# EAGLE design V5 (EAGLE 9.5.2)
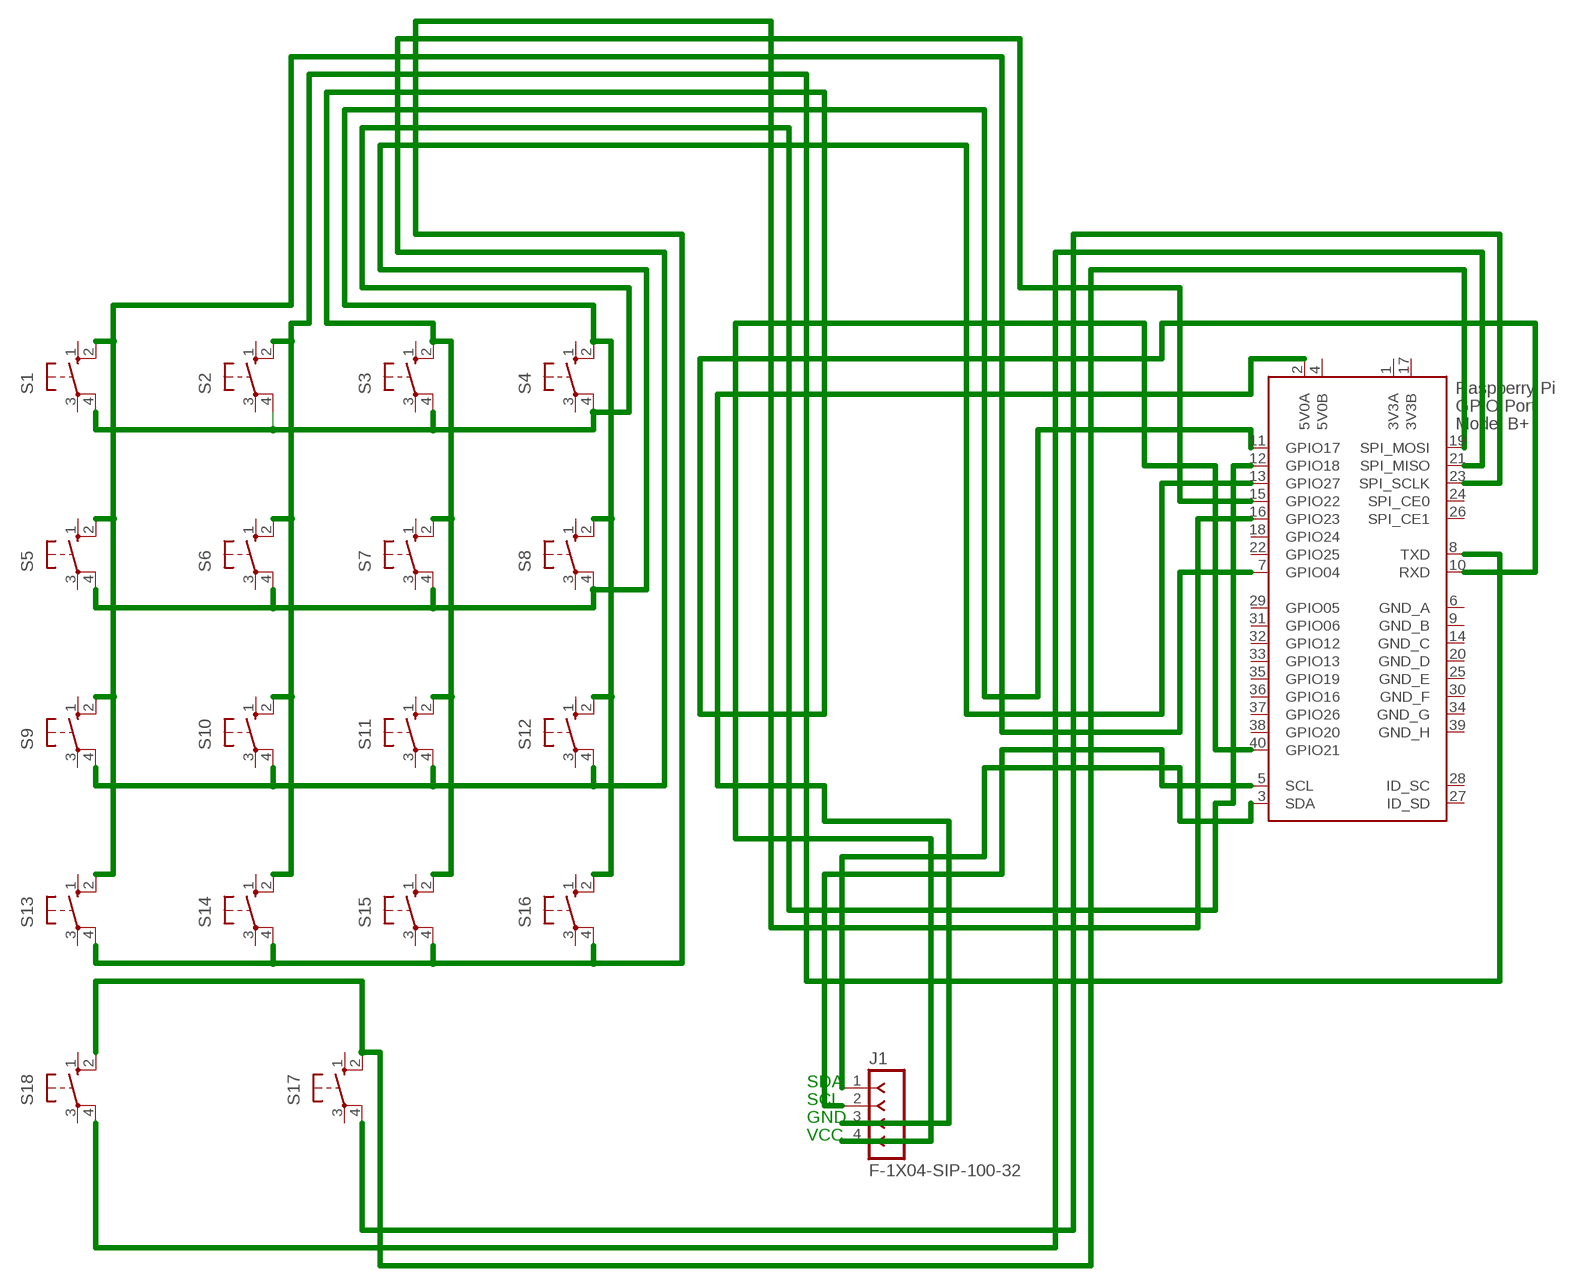
[diagram p0: schematic, sheet 1]

## Parts
J1  F-1X04-SIP-100-32  [SIP-100-04-32]
S1  40-XX  [B3F-40XX]
S2  40-XX  [B3F-40XX]
S3  40-XX  [B3F-40XX]
S4  40-XX  [B3F-40XX]
S5  40-XX  [B3F-40XX]
S6  40-XX  [B3F-40XX]
S7  40-XX  [B3F-40XX]
S8  40-XX  [B3F-40XX]
S9  40-XX  [B3F-40XX]
S10  40-XX  [B3F-40XX]
S11  40-XX  [B3F-40XX]
S12  40-XX  [B3F-40XX]
S13  40-XX  [B3F-40XX]
S14  40-XX  [B3F-40XX]
S15  40-XX  [B3F-40XX]
S16  40-XX  [B3F-40XX]
S17  40-XX  [B3F-40XX]
S18  40-XX  [B3F-40XX]
X1  RASPI_GPIO_B+#_PIN  [RASPI_GPIO_B+_PIN]

## Nets
N$1: S1.2(S1) S5.2(S1) S9.2(S1) S13.2(S1) X1.7(GPIO04)
N$2: S2.2(S1) S6.2(S1) S10.2(S1) S14.2(S1) X1.8(TXD)
N$3: S3.2(S1) S7.2(S1) S11.2(S1) S15.2(S1) X1.10(RXD)
N$4: J1.4 X1.40(GPIO21)
N$5: S13.4(P1) S14.4(P1) S15.4(P1) S16.4(P1) X1.16(GPIO23)
N$6: S9.4(P1) S10.4(P1) S11.4(P1) S12.4(P1) X1.15(GPIO22)
N$7: S5.4(P1) S6.4(P1) S7.4(P1) S8.4(P1) X1.13(GPIO27)
N$8: S1.4(P1) S2.4(P1) S3.4(P1) S4.4(P1) X1.12(GPIO18)
N$9: S17.2(S1) S18.2(S1) X1.19(SPI_MOSI)
N$10: S18.4(P1) X1.21(SPI_MISO)
N$11: S17.4(P1) X1.23(SPI_SCLK)
N$15: J1.1 X1.3(SDA)
N$16: J1.2 X1.5(SCL)
N$18: J1.3 X1.2(5V0A)
N$19: S4.2(S1) S8.2(S1) S12.2(S1) S16.2(S1) X1.11(GPIO17)
Unconnected: S1.1(S) S1.3(P) S2.1(S) S2.3(P) S3.1(S) S3.3(P) S4.1(S) S4.3(P) S5.1(S) S5.3(P) S6.1(S) S6.3(P) S7.1(S) S7.3(P) S8.1(S) S8.3(P) S9.1(S) S9.3(P) S10.1(S) S10.3(P) S11.1(S) S11.3(P) S12.1(S) S12.3(P) S13.1(S) S13.3(P) S14.1(S) S14.3(P) S15.1(S) S15.3(P) S16.1(S) S16.3(P) S17.1(S) S17.3(P) S18.1(S) S18.3(P) X1.18(GPIO24) X1.22(GPIO25) X1.24(SPI_CE0) X1.26(SPI_CE1) X1.27(ID_SD) X1.28(ID_SC) X1.29(GPIO05) X1.31(GPIO06) X1.32(GPIO12) X1.33(GPIO13) X1.35(GPIO19) X1.36(GPIO16) X1.37(GPIO26) X1.38(GPIO20)

## Notes on the sheet
- SDA
- SCL
- GND
- VCC

## Power pins joined to a net without a drawn wire
3V3A: X1.1(3V3A)
3V3B: X1.17(3V3B)
5V0B: X1.4(5V0B)
GND_A: X1.6(GND_A)
GND_B: X1.9(GND_B)
GND_C: X1.14(GND_C)
GND_D: X1.20(GND_D)
GND_E: X1.25(GND_E)
GND_F: X1.30(GND_F)
GND_G: X1.34(GND_G)
GND_H: X1.39(GND_H)

## Library data of the parts
J1 = con-headers-jp:F-1X04-: FEMALE HEADER
S1-S18 = switch-omron:40-XX: OMRON SWITCH; MF: OMRON COMPONENTS USA; MPN: B3F-4000; OC_FARNELL: 176434; OC_NEWARK: 36K3105
X1 = raspberrypi_bastelstube_v13:RASPI_GPIO_B+#: 2x20 header connector, all pins connected

## Net classes
0 default: width 0.33 mm, clearance 0.33 mm

## Board
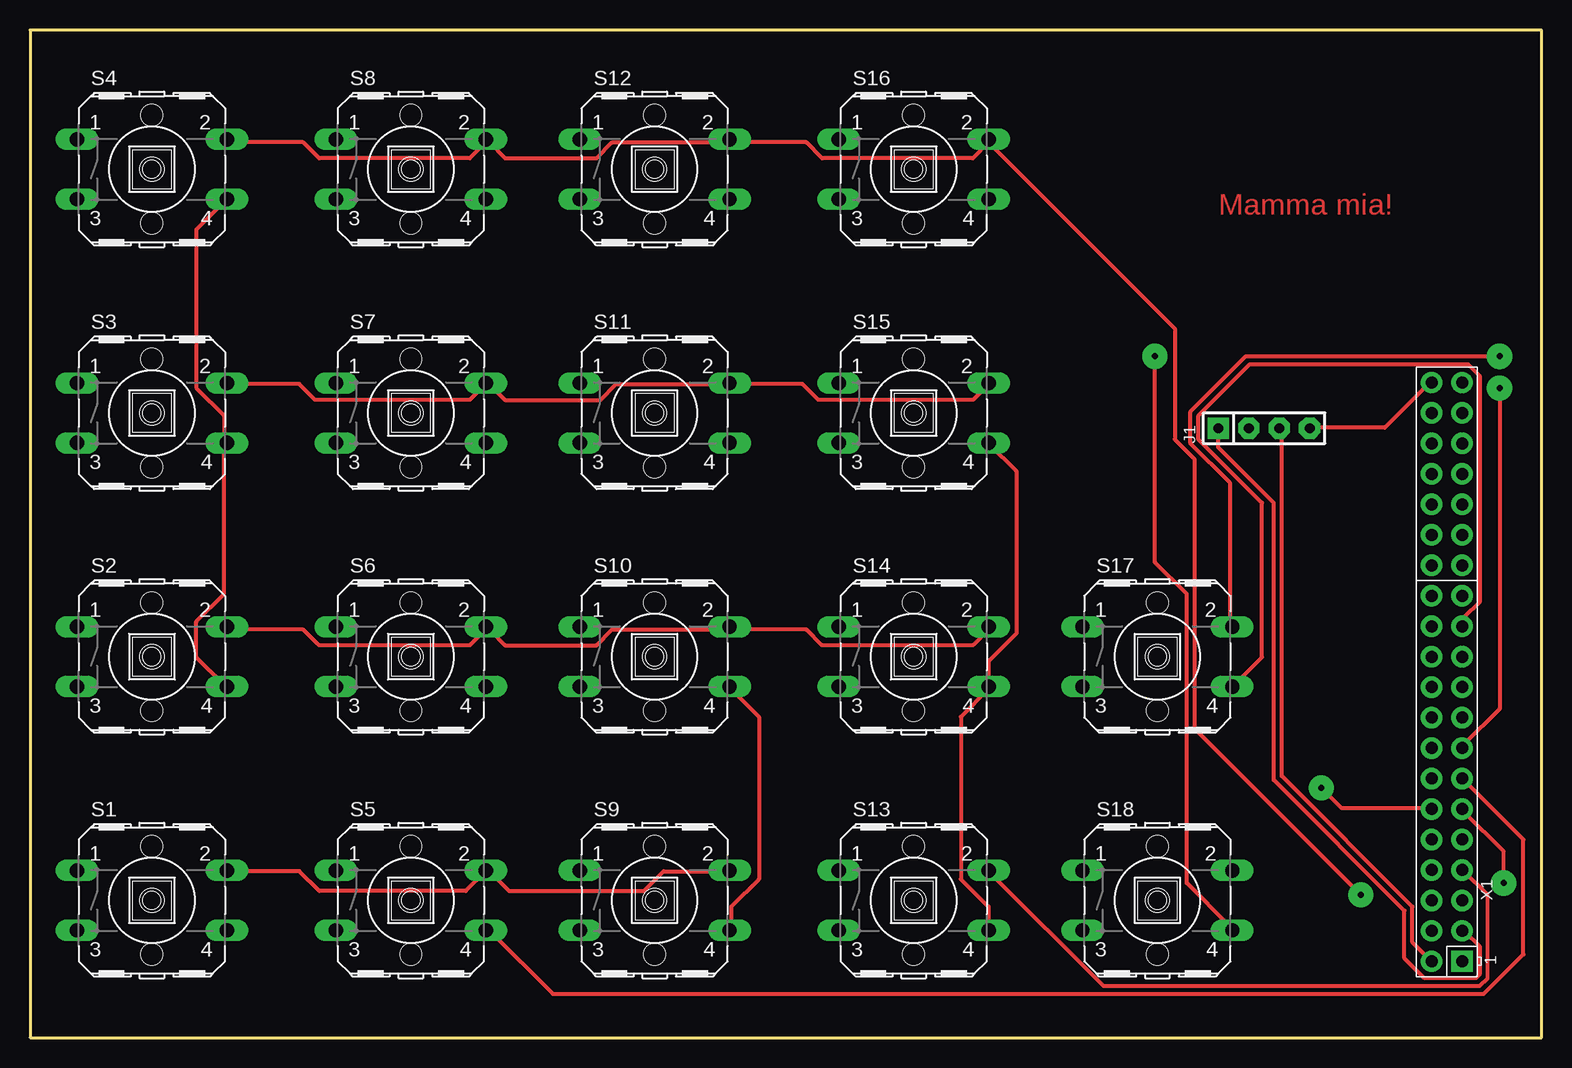
[diagram p1: board, top side]
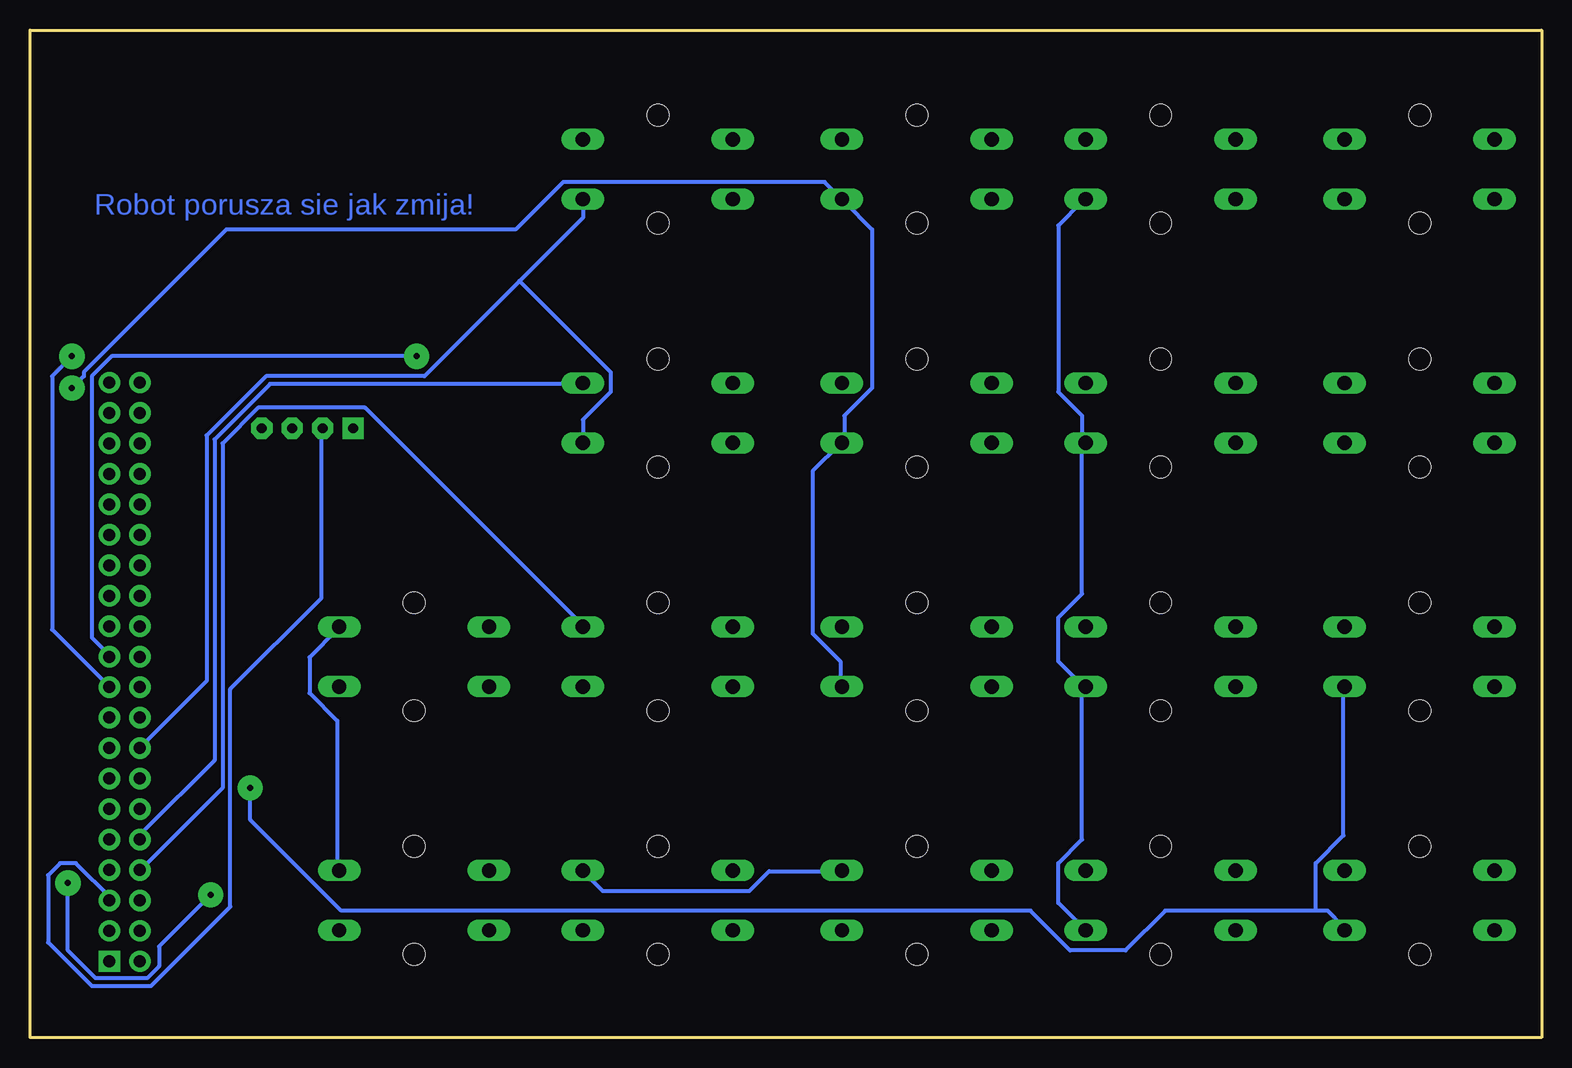
[diagram p2: board, bottom side, seen from below]

Size 126 x 84 mm. Coordinates in mm from the lower left corner, seen from the top.
Outline: 0,84 0,0 126,0 126,84 0,84
Copper layers (1*16): Top 0.035mm / dielectric 1.5mm / Bottom 0.035mm
Design rules "default *": minimum track width 6mil, minimum drill 0.5mm, track to track 13mil, track to pad 13mil, pad to pad 13mil, via to via 13mil, smd to smd 13mil, copper to edge 40mil, drill to drill 6mil, minimum pad ring 10mil, minimum via ring 0.8mm, stop-mask expansion 4mil, vias tented up to drill 0mil, thermal gap 10mil

### Footprints (pad centres in the part's own frame; a part is rotated, then mirrored left to right if it is on the bottom)
SIP-100-04-32 = drill 0.813 pad 1.778 square: 1 -3.81,0 | drill 0.813 pad 1.778 octagon: 2 -1.27,0; 3 1.27,0; 4 3.81,0
B3F-40XX = drill 1.194 long: 1 -6.248,2.489; 2 6.248,2.489; 3 -6.248,-2.489; 4 6.248,-2.489 | hole 1.803: 0,-4.496; 0,4.496
RASPI_GPIO_B+_PIN = drill 1 pad 1.778 square: 1 -24.13,-1.27 | drill 1 pad 1.778: 2 -24.13,1.27; 3 -21.59,-1.27; 4 -21.59,1.27; 5 -19.05,-1.27; 6 -19.05,1.27; 7 -16.51,-1.27; 8 -16.51,1.27; 9 -13.97,-1.27; 10 -13.97,1.27; 11 -11.43,-1.27; 12 -11.43,1.27; 13 -8.89,-1.27; 14 -8.89,1.27; 15 -6.35,-1.27; 16 -6.35,1.27; 17 -3.81,-1.27; 18 -3.81,1.27; 19 -1.27,-1.27; 20 -1.27,1.27; 21 1.27,-1.27; 22 1.27,1.27; 23 3.81,-1.27; 24 3.81,1.27; 25 6.35,-1.27; 26 6.35,1.27; 27 8.89,-1.27; 28 8.89,1.27; 29 11.43,-1.27; 30 11.43,1.27; 31 13.97,-1.27; 32 13.97,1.27; 33 16.51,-1.27; 34 16.51,1.27; 35 19.05,-1.27; 36 19.05,1.27; 37 21.59,-1.27; 38 21.59,1.27; 39 24.13,-1.27; 40 24.13,1.27

### Placement (x,y rotation side)
J1  102.87,50.8 0 top
S1  10.16,11.43 0 top
S2  10.16,31.75 0 top
S3  10.16,52.07 0 top
S4  10.16,72.39 0 top
S5  31.75,11.43 0 top
S6  31.75,31.75 0 top
S7  31.75,52.07 0 top
S8  31.75,72.39 0 top
S9  52.07,11.43 0 top
S10  52.07,31.75 0 top
S11  52.07,52.07 0 top
S12  52.07,72.39 0 top
S13  73.66,11.43 0 top
S14  73.66,31.75 0 top
S15  73.66,52.07 0 top
S16  73.66,72.39 0 top
S17  93.98,31.75 0 top
S18  93.98,11.43 0 top
X1  118.11,30.48 90 top

### Tracks (layer width: path | path; a pad name or v marks a point on that pad's centre or on a via)
N$1
  Top 0.33: S1.2 16.51,13.87 22.45,13.87 24.11,12.22 36.32,12.22 37.97,13.87 S5.2 38.3,13.87 39.95,12.22 51.18,12.22 52.83,13.87 58.12,13.87 S9.2 | X1.7 119.53,13.87 121.51,11.89 121.51,4.95 120.85,4.29 89.48,4.29 79.91,13.87 S13.2
  Bottom 0.33: S9.2 58.45,13.87 64.39,13.87 66.04,12.22 78.26,12.22 79.91,13.87 S13.2
N$2
  Top 0.33: S2.2 16.51,34.01 22.78,34.01 24.11,32.69 36.65,32.69 37.97,34.01 S6.2 38.3,34.01 39.62,32.69 47.22,32.69 48.54,34.01 58.12,34.01 S10.2 58.45,34.01 64.72,34.01 66.04,32.69 78.59,32.69 79.91,34.01 S14.2
  Bottom 0.33: X1.8 116.56,14.2 109.96,20.8 109.96,49.53 106.98,52.5 98.07,52.5 79.91,34.34 S14.2
N$3
  Top 0.33: S3.2 16.51,54.48 22.45,54.48 23.77,53.16 36.65,53.16 37.97,54.48 S7.2 38.3,54.48 39.62,53.16 47.55,53.16 48.87,54.48 58.12,54.48 S11.2 58.45,54.48 64.39,54.48 65.71,53.16 78.59,53.16 79.91,54.48 S15.2
  Bottom 0.33: X1.10 116.56,16.51 116.56,17.17 110.62,23.11 110.62,49.86 105.99,54.48 79.91,54.48 S15.2
N$4
  Top 0.33: J1.4 106.98,50.85 112.93,50.85 116.56,54.48 X1.40
N$5
  Top 0.33: S13.4 79.91,10.9 77.6,13.21 77.6,26.75 79.91,29.06 S14.4 79.91,31.37 82.22,33.68 82.22,47.22 79.91,49.53 S15.4
  Bottom 0.33: 85.19,63.07 79.91,68.35 S16.4 | 85.19,63.07 93.12,55.14 106.32,55.14 111.28,50.19 111.28,29.72 116.56,24.43 X1.16 | S15.4 79.91,51.51 77.6,53.82 77.6,55.47 85.19,63.07
N$6  (via drill 0.5)
  Top 0.33: S9.4 58.45,9.25 58.45,10.9 60.76,13.21 60.76,26.75 58.45,29.06 S10.4 | v122.5,54.15 122.5,27.41 119.53,24.43 X1.15
  Bottom 0.33: v122.5,54.15 121.51,55.14 121.51,55.47 109.63,67.36 85.52,67.36 81.56,71.32 59.77,71.32 58.45,70 S12.4 58.12,69.67 55.8,67.36 55.8,54.15 58.12,51.84 58.12,49.86 S11.4 58.45,49.53 60.76,47.22 60.76,33.68 58.45,31.37 58.45,29.39 S10.4
N$7
  Top 0.33: X1.13 119.53,21.46 124.48,16.51 124.48,6.93 121.18,3.63 43.59,3.63 38.3,8.91 S5.4
  Bottom 0.33: S8.4 38.3,69.67 40.28,67.69 40.28,53.82 38.3,51.84 38.3,49.86 S7.4 38.3,49.53 38.3,36.98 40.28,35 40.28,31.37 38.3,29.39 S6.4 38.3,29.06 38.3,16.51 40.28,14.53 40.28,11.23 S5.4
N$8  (via drill 0.5)
  Top 0.33: S4.4 13.87,67.36 13.87,54.15 16.18,51.84 16.18,49.86 S3.4 16.18,49.53 16.18,36.98 13.87,34.67 13.87,31.7 16.18,29.39 S2.4 | v107.64,20.8 109.3,19.15 116.56,19.15 X1.12
  Bottom 0.33: v107.64,20.8 107.64,18.16 100.05,10.57 42.6,10.57 39.29,7.26 34.67,7.26 31.37,10.57 18.82,10.57 | 18.82,10.57 17.83,10.57 16.51,9.25 S1.4 | 18.82,10.57 18.82,14.53 16.51,16.84 16.51,29.06 S2.4
N$9  (via drill 0.5)
  Top 0.33: v122.5,56.79 101.37,56.79 96.75,52.17 96.75,49.53 100.05,46.23 100.05,34.34 S17.2
  Bottom 0.33: v122.5,56.79 124.16,55.14 124.16,34.01 119.53,29.39 X1.19 | S18.2 100.38,14.2 100.38,26.42 102.69,28.73 102.69,31.7 100.38,34.01 S17.2
N$10  (via drill 0.5)
  Top 0.33: v93.78,56.79 93.78,39.62 96.42,36.98 96.42,12.88 100.05,9.25 S18.4
  Bottom 0.33: v93.78,56.79 119.2,56.79 120.85,55.14 120.85,33.35 119.53,32.03 X1.21
N$11
  Top 0.33: X1.23 119.53,34.34 119.53,35 120.85,36.32 120.85,55.14 119.86,56.13 101.7,56.13 97.41,51.84 97.41,49.86 102.69,44.58 102.69,31.7 100.38,29.39 S17.4
N$15
  Top 0.33: J1.1 99.06,49.2 103.68,44.58 103.68,21.46 114.58,10.57 114.58,6.6 116.23,4.95 120.52,4.95 120.85,5.28 120.85,7.59 119.53,8.91 X1.3
N$16
  Bottom 0.33: J1.2 101.7,50.52 101.7,36.65 109.3,29.06 109.3,10.9 115.9,4.29 120.85,4.29 124.48,7.92 124.48,13.54 123.5,14.53 122.17,14.53 119.2,11.56 X1.5
N$18
  Top 0.33: J1.3 104.34,50.52 104.34,21.79 115.24,10.9 115.24,7.92 116.56,6.6 X1.2
N$19  (via drill 0.5)
  Top 0.33: S4.2 16.51,74.62 22.78,74.62 24.11,73.3 36.65,73.3 37.97,74.62 S8.2 38.3,74.62 39.62,73.3 47.22,73.3 48.54,74.62 58.12,74.62 S12.2 58.45,74.62 64.72,74.62 66.04,73.3 78.59,73.3 79.91,74.62 | v122.83,12.88 122.83,15.52 119.53,18.82 X1.11 | v110.95,11.89 97.08,25.76 97.08,48.21 95.43,49.86 95.43,59.11 79.91,74.62 | 79.91,74.62 S16.2
  Bottom 0.33: v122.83,12.88 122.83,7.26 120.52,4.95 116.23,4.95 115.24,5.94 115.24,7.59 v110.95,11.89

### Text on the board
Top: Mamma mia!
Bottom: Robot porusza sie jak zmija!